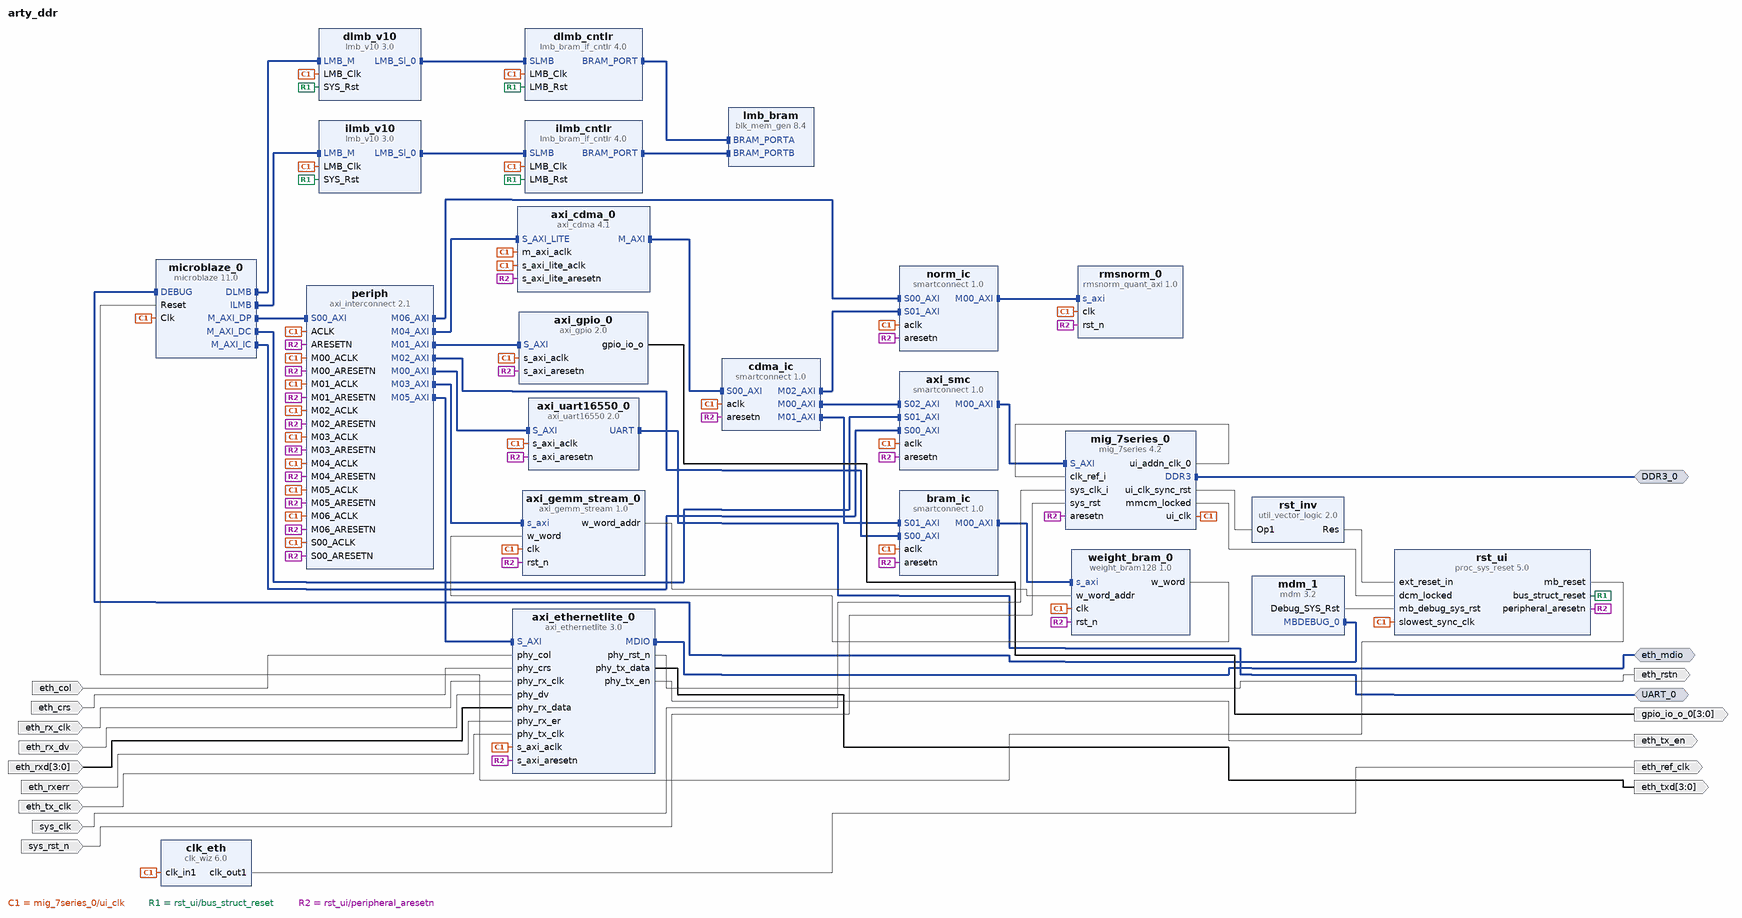
[diagram p0: block diagram of the top level]
# Vivado block design arty_ddr, xc7a100tcsg324-1, Vivado 2025.2
create_bd_design arty_ddr

create_bd_intf_port -mode Master -vlnv xilinx.com:interface:ddrx_rtl:1.0 DDR3_0
create_bd_intf_port -mode Master -vlnv xilinx.com:interface:mdio_rtl:1.0 eth_mdio
create_bd_intf_port -mode Master -vlnv xilinx.com:interface:uart_rtl:1.0 UART_0
create_bd_port -dir I -type clk sys_clk
set_property -dict {CONFIG.FREQ_HZ 100000000} [get_bd_ports sys_clk]
create_bd_port -dir I -type rst sys_rst_n
set_property -dict {CONFIG.POLARITY ACTIVE_LOW} [get_bd_ports sys_rst_n]
create_bd_port -dir I eth_tx_clk
create_bd_port -dir I eth_rx_clk
create_bd_port -dir I eth_crs
create_bd_port -dir I eth_col
create_bd_port -dir I eth_rx_dv
create_bd_port -dir I -from 3 -to 0 eth_rxd
create_bd_port -dir I eth_rxerr
create_bd_port -dir O eth_tx_en
create_bd_port -dir O -from 3 -to 0 eth_txd
create_bd_port -dir O eth_rstn
create_bd_port -dir O -type clk eth_ref_clk
create_bd_port -dir O -from 3 -to 0 gpio_io_o_0

create_bd_cell -type ip -vlnv xilinx.com:ip:mig_7series:4.2 mig_7series_0
set_property -dict {CONFIG.XML_INPUT_FILE ../../../../../../mig_a.prj} [get_bd_cells mig_7series_0]
create_bd_cell -type ip -vlnv xilinx.com:ip:proc_sys_reset:5.0 rst_ui
create_bd_cell -type ip -vlnv xilinx.com:ip:util_vector_logic:2.0 rst_inv
set_property -dict {CONFIG.C_OPERATION not CONFIG.C_SIZE 1} [get_bd_cells rst_inv]
create_bd_cell -type ip -vlnv xilinx.com:ip:microblaze:11.0 microblaze_0
set_property -dict [list \
  CONFIG.C_CACHE_BYTE_SIZE 16384 \
  CONFIG.C_DCACHE_ALWAYS_USED 1 \
  CONFIG.C_DCACHE_BASEADDR 0x0000000080000000 \
  CONFIG.C_DCACHE_BYTE_SIZE 16384 \
  CONFIG.C_DCACHE_HIGHADDR 0x000000008FFFFFFF \
  CONFIG.C_DEBUG_ENABLED 1 \
  CONFIG.C_D_AXI 1 \
  CONFIG.C_ICACHE_ALWAYS_USED 1 \
  CONFIG.C_ICACHE_BASEADDR 0x0000000080000000 \
  CONFIG.C_ICACHE_HIGHADDR 0x000000008FFFFFFF \
  CONFIG.C_USE_BARREL 1 \
  CONFIG.C_USE_DCACHE 1 \
  CONFIG.C_USE_DIV 1 \
  CONFIG.C_USE_FPU 0 \
  CONFIG.C_USE_HW_MUL 1 \
  CONFIG.C_USE_ICACHE 1 \
  CONFIG.C_USE_MSR_INSTR 1 \
  CONFIG.C_USE_PCMP_INSTR 1 \
] [get_bd_cells microblaze_0]
create_bd_cell -type ip -vlnv xilinx.com:ip:lmb_v10:3.0 dlmb_v10
create_bd_cell -type ip -vlnv xilinx.com:ip:lmb_bram_if_cntlr:4.0 dlmb_cntlr
create_bd_cell -type ip -vlnv xilinx.com:ip:lmb_v10:3.0 ilmb_v10
create_bd_cell -type ip -vlnv xilinx.com:ip:lmb_bram_if_cntlr:4.0 ilmb_cntlr
create_bd_cell -type ip -vlnv xilinx.com:ip:blk_mem_gen:8.4 lmb_bram
set_property -dict {CONFIG.Memory_Type True_Dual_Port_RAM CONFIG.use_bram_block BRAM_Controller} [get_bd_cells lmb_bram]
create_bd_cell -type ip -vlnv xilinx.com:ip:mdm:3.2 mdm_1
create_bd_cell -type ip -vlnv xilinx.com:ip:smartconnect:1.0 axi_smc
set_property -dict {CONFIG.NUM_MI 1 CONFIG.NUM_SI 3} [get_bd_cells axi_smc]
create_bd_cell -type ip -vlnv xilinx.com:ip:axi_interconnect:2.1 periph
set_property -dict {CONFIG.NUM_MI 7 CONFIG.NUM_SI 1} [get_bd_cells periph]
create_bd_cell -type ip -vlnv xilinx.com:ip:axi_uart16550:2.0 axi_uart16550_0
set_property -dict {CONFIG.C_S_AXI_ACLK_FREQ_HZ 81000000 CONFIG.C_S_AXI_ACLK_FREQ_HZ_d 81} [get_bd_cells axi_uart16550_0]
create_bd_cell -type ip -vlnv xilinx.com:ip:axi_gpio:2.0 axi_gpio_0
set_property -dict {CONFIG.C_ALL_OUTPUTS 1 CONFIG.C_GPIO_WIDTH 4} [get_bd_cells axi_gpio_0]
create_bd_cell -type ip -vlnv shepherdscientific.com:user:weight_bram128:1.0 weight_bram_0
create_bd_cell -type ip -vlnv shepherdscientific.com:user:axi_gemm_stream:1.0 axi_gemm_stream_0
create_bd_cell -type ip -vlnv xilinx.com:ip:axi_cdma:4.1 axi_cdma_0
set_property -dict {CONFIG.C_INCLUDE_SG 0 CONFIG.C_M_AXI_MAX_BURST_LEN 256} [get_bd_cells axi_cdma_0]
create_bd_cell -type ip -vlnv xilinx.com:ip:smartconnect:1.0 bram_ic
set_property -dict {CONFIG.NUM_MI 1 CONFIG.NUM_SI 2} [get_bd_cells bram_ic]
create_bd_cell -type ip -vlnv xilinx.com:ip:smartconnect:1.0 cdma_ic
set_property -dict {CONFIG.NUM_MI 3 CONFIG.NUM_SI 1} [get_bd_cells cdma_ic]
create_bd_cell -type ip -vlnv shepherdscientific.com:user:rmsnorm_quant_axi:1.0 rmsnorm_0
create_bd_cell -type ip -vlnv xilinx.com:ip:smartconnect:1.0 norm_ic
set_property -dict {CONFIG.NUM_MI 1 CONFIG.NUM_SI 2} [get_bd_cells norm_ic]
create_bd_cell -type ip -vlnv xilinx.com:ip:axi_ethernetlite:3.0 axi_ethernetlite_0
set_property -dict {CONFIG.C_INCLUDE_MDIO 1 CONFIG.C_RX_PING_PONG 1 CONFIG.C_TX_PING_PONG 1} [get_bd_cells axi_ethernetlite_0]
create_bd_cell -type ip -vlnv xilinx.com:ip:clk_wiz:6.0 clk_eth
set_property -dict [list \
  CONFIG.CLKOUT1_REQUESTED_OUT_FREQ 25.000 \
  CONFIG.USE_LOCKED false \
  CONFIG.USE_RESET false \
] [get_bd_cells clk_eth]

# ---- connections ----

connect_bd_intf_net [get_bd_intf_pins dlmb_v10/LMB_Sl_0] [get_bd_intf_pins dlmb_cntlr/SLMB]
connect_bd_intf_net [get_bd_intf_pins ilmb_v10/LMB_Sl_0] [get_bd_intf_pins ilmb_cntlr/SLMB]
connect_bd_intf_net [get_bd_intf_pins axi_cdma_0/M_AXI] [get_bd_intf_pins cdma_ic/S00_AXI]
connect_bd_intf_net [get_bd_intf_pins axi_ethernetlite_0/MDIO] [get_bd_intf_ports eth_mdio]
connect_bd_intf_net [get_bd_intf_pins axi_smc/M00_AXI] [get_bd_intf_pins mig_7series_0/S_AXI]
connect_bd_intf_net [get_bd_intf_ports UART_0] [get_bd_intf_pins axi_uart16550_0/UART]
connect_bd_intf_net [get_bd_intf_pins bram_ic/M00_AXI] [get_bd_intf_pins weight_bram_0/s_axi]
connect_bd_intf_net [get_bd_intf_pins cdma_ic/M00_AXI] [get_bd_intf_pins axi_smc/S02_AXI]
connect_bd_intf_net [get_bd_intf_pins cdma_ic/M01_AXI] [get_bd_intf_pins bram_ic/S01_AXI]
connect_bd_intf_net [get_bd_intf_pins cdma_ic/M02_AXI] [get_bd_intf_pins norm_ic/S01_AXI]
connect_bd_intf_net [get_bd_intf_pins dlmb_cntlr/BRAM_PORT] [get_bd_intf_pins lmb_bram/BRAM_PORTA]
connect_bd_intf_net [get_bd_intf_pins ilmb_cntlr/BRAM_PORT] [get_bd_intf_pins lmb_bram/BRAM_PORTB]
connect_bd_intf_net [get_bd_intf_pins mdm_1/MBDEBUG_0] [get_bd_intf_pins microblaze_0/DEBUG]
connect_bd_intf_net [get_bd_intf_pins microblaze_0/DLMB] [get_bd_intf_pins dlmb_v10/LMB_M]
connect_bd_intf_net [get_bd_intf_pins microblaze_0/ILMB] [get_bd_intf_pins ilmb_v10/LMB_M]
connect_bd_intf_net [get_bd_intf_pins microblaze_0/M_AXI_DC] [get_bd_intf_pins axi_smc/S01_AXI]
connect_bd_intf_net [get_bd_intf_pins microblaze_0/M_AXI_DP] [get_bd_intf_pins periph/S00_AXI]
connect_bd_intf_net [get_bd_intf_pins microblaze_0/M_AXI_IC] [get_bd_intf_pins axi_smc/S00_AXI]
connect_bd_intf_net [get_bd_intf_ports DDR3_0] [get_bd_intf_pins mig_7series_0/DDR3]
connect_bd_intf_net [get_bd_intf_pins norm_ic/M00_AXI] [get_bd_intf_pins rmsnorm_0/s_axi]
connect_bd_intf_net [get_bd_intf_pins periph/M00_AXI] [get_bd_intf_pins axi_uart16550_0/S_AXI]
connect_bd_intf_net [get_bd_intf_pins periph/M01_AXI] [get_bd_intf_pins axi_gpio_0/S_AXI]
connect_bd_intf_net [get_bd_intf_pins periph/M02_AXI] [get_bd_intf_pins bram_ic/S00_AXI]
connect_bd_intf_net [get_bd_intf_pins periph/M03_AXI] [get_bd_intf_pins axi_gemm_stream_0/s_axi]
connect_bd_intf_net [get_bd_intf_pins periph/M04_AXI] [get_bd_intf_pins axi_cdma_0/S_AXI_LITE]
connect_bd_intf_net [get_bd_intf_pins periph/M05_AXI] [get_bd_intf_pins axi_ethernetlite_0/S_AXI]
connect_bd_intf_net [get_bd_intf_pins periph/M06_AXI] [get_bd_intf_pins norm_ic/S00_AXI]
connect_bd_net [get_bd_pins axi_ethernetlite_0/phy_rst_n] [get_bd_ports eth_rstn]
connect_bd_net [get_bd_pins axi_ethernetlite_0/phy_tx_data] [get_bd_ports eth_txd]
connect_bd_net [get_bd_pins axi_ethernetlite_0/phy_tx_en] [get_bd_ports eth_tx_en]
connect_bd_net [get_bd_pins axi_gemm_stream_0/w_word_addr] [get_bd_pins weight_bram_0/w_word_addr]
connect_bd_net [get_bd_pins axi_gpio_0/gpio_io_o] [get_bd_ports gpio_io_o_0]
connect_bd_net [get_bd_pins clk_eth/clk_out1] [get_bd_ports eth_ref_clk]
connect_bd_net [get_bd_ports eth_col] [get_bd_pins axi_ethernetlite_0/phy_col]
connect_bd_net [get_bd_ports eth_crs] [get_bd_pins axi_ethernetlite_0/phy_crs]
connect_bd_net [get_bd_ports eth_rx_clk] [get_bd_pins axi_ethernetlite_0/phy_rx_clk]
connect_bd_net [get_bd_ports eth_rx_dv] [get_bd_pins axi_ethernetlite_0/phy_dv]
connect_bd_net [get_bd_ports eth_rxd] [get_bd_pins axi_ethernetlite_0/phy_rx_data]
connect_bd_net [get_bd_ports eth_rxerr] [get_bd_pins axi_ethernetlite_0/phy_rx_er]
connect_bd_net [get_bd_ports eth_tx_clk] [get_bd_pins axi_ethernetlite_0/phy_tx_clk]
connect_bd_net [get_bd_pins mdm_1/Debug_SYS_Rst] [get_bd_pins rst_ui/mb_debug_sys_rst]
connect_bd_net [get_bd_pins mig_7series_0/mmcm_locked] [get_bd_pins rst_ui/dcm_locked]
connect_bd_net [get_bd_pins mig_7series_0/ui_addn_clk_0] [get_bd_pins mig_7series_0/clk_ref_i]
connect_bd_net [get_bd_pins mig_7series_0/ui_clk] \
  [get_bd_pins rst_ui/slowest_sync_clk] [get_bd_pins microblaze_0/Clk] [get_bd_pins dlmb_v10/LMB_Clk] \
  [get_bd_pins dlmb_cntlr/LMB_Clk] [get_bd_pins ilmb_v10/LMB_Clk] [get_bd_pins ilmb_cntlr/LMB_Clk] [get_bd_pins axi_smc/aclk] \
  [get_bd_pins periph/ACLK] [get_bd_pins periph/S00_ACLK] [get_bd_pins periph/M00_ACLK] [get_bd_pins periph/M01_ACLK] \
  [get_bd_pins periph/M02_ACLK] [get_bd_pins periph/M03_ACLK] [get_bd_pins axi_uart16550_0/s_axi_aclk] \
  [get_bd_pins axi_gpio_0/s_axi_aclk] [get_bd_pins weight_bram_0/clk] [get_bd_pins axi_gemm_stream_0/clk] \
  [get_bd_pins periph/M04_ACLK] [get_bd_pins periph/M05_ACLK] [get_bd_pins periph/M06_ACLK] \
  [get_bd_pins axi_cdma_0/s_axi_lite_aclk] [get_bd_pins axi_cdma_0/m_axi_aclk] [get_bd_pins bram_ic/aclk] \
  [get_bd_pins cdma_ic/aclk] [get_bd_pins norm_ic/aclk] [get_bd_pins rmsnorm_0/clk] \
  [get_bd_pins axi_ethernetlite_0/s_axi_aclk] [get_bd_pins clk_eth/clk_in1]
connect_bd_net [get_bd_pins mig_7series_0/ui_clk_sync_rst] [get_bd_pins rst_inv/Op1]
connect_bd_net [get_bd_pins rst_inv/Res] [get_bd_pins rst_ui/ext_reset_in]
connect_bd_net [get_bd_pins rst_ui/bus_struct_reset] \
  [get_bd_pins dlmb_v10/SYS_Rst] [get_bd_pins dlmb_cntlr/LMB_Rst] [get_bd_pins ilmb_v10/SYS_Rst] \
  [get_bd_pins ilmb_cntlr/LMB_Rst]
connect_bd_net [get_bd_pins rst_ui/mb_reset] [get_bd_pins microblaze_0/Reset]
connect_bd_net [get_bd_pins rst_ui/peripheral_aresetn] \
  [get_bd_pins mig_7series_0/aresetn] [get_bd_pins axi_smc/aresetn] [get_bd_pins periph/ARESETN] \
  [get_bd_pins periph/S00_ARESETN] [get_bd_pins periph/M00_ARESETN] [get_bd_pins periph/M01_ARESETN] \
  [get_bd_pins periph/M02_ARESETN] [get_bd_pins periph/M03_ARESETN] [get_bd_pins axi_uart16550_0/s_axi_aresetn] \
  [get_bd_pins axi_gpio_0/s_axi_aresetn] [get_bd_pins weight_bram_0/rst_n] [get_bd_pins axi_gemm_stream_0/rst_n] \
  [get_bd_pins periph/M04_ARESETN] [get_bd_pins periph/M05_ARESETN] [get_bd_pins periph/M06_ARESETN] \
  [get_bd_pins axi_cdma_0/s_axi_lite_aresetn] [get_bd_pins bram_ic/aresetn] [get_bd_pins cdma_ic/aresetn] \
  [get_bd_pins norm_ic/aresetn] [get_bd_pins rmsnorm_0/rst_n] [get_bd_pins axi_ethernetlite_0/s_axi_aresetn]
connect_bd_net [get_bd_ports sys_clk] [get_bd_pins mig_7series_0/sys_clk_i]
connect_bd_net [get_bd_ports sys_rst_n] [get_bd_pins mig_7series_0/sys_rst]
connect_bd_net [get_bd_pins weight_bram_0/w_word] [get_bd_pins axi_gemm_stream_0/w_word]
set_property HDL_ATTRIBUTE.BMM_INFO_PROCESSOR {microblaze-le > arty_ddr dlmb_cntlr} [get_bd_cells microblaze_0]
set_property HDL_ATTRIBUTE.KEEP_HIERARCHY yes [get_bd_cells microblaze_0]
set_property HDL_ATTRIBUTE.BMM_INFO_ADDRESS_SPACE {byte  0x00000000 32 > arty_ddr lmb_bram} [get_bd_cells dlmb_cntlr]
set_property HDL_ATTRIBUTE.KEEP_HIERARCHY yes [get_bd_cells dlmb_cntlr]

# ---- address map ----
assign_bd_address -offset 0x44100000 -range 256K -target_address_space [get_bd_addr_spaces axi_cdma_0/Data] [get_bd_addr_segs weight_bram_0/s_axi/reg0]
assign_bd_address -offset 0x44400000 -range 128K -target_address_space [get_bd_addr_spaces axi_cdma_0/Data] [get_bd_addr_segs rmsnorm_0/s_axi/reg0]
assign_bd_address -offset 0x80000000 -range 256M -target_address_space [get_bd_addr_spaces axi_cdma_0/Data] [get_bd_addr_segs mig_7series_0/memmap/memaddr]
assign_bd_address -offset 0x00000000 -range 64K -target_address_space [get_bd_addr_spaces microblaze_0/Data] [get_bd_addr_segs dlmb_cntlr/SLMB/Mem]
assign_bd_address -offset 0x40000000 -range 64K -target_address_space [get_bd_addr_spaces microblaze_0/Data] [get_bd_addr_segs axi_gpio_0/S_AXI/Reg]
assign_bd_address -offset 0x40600000 -range 64K -target_address_space [get_bd_addr_spaces microblaze_0/Data] [get_bd_addr_segs axi_uart16550_0/S_AXI/Reg]
assign_bd_address -offset 0x40E00000 -range 64K -target_address_space [get_bd_addr_spaces microblaze_0/Data] [get_bd_addr_segs axi_ethernetlite_0/S_AXI/Reg]
assign_bd_address -offset 0x44100000 -range 256K -target_address_space [get_bd_addr_spaces microblaze_0/Data] [get_bd_addr_segs weight_bram_0/s_axi/reg0]
assign_bd_address -offset 0x44200000 -range 4K -target_address_space [get_bd_addr_spaces microblaze_0/Data] [get_bd_addr_segs axi_gemm_stream_0/s_axi/reg0]
assign_bd_address -offset 0x44300000 -range 64K -target_address_space [get_bd_addr_spaces microblaze_0/Data] [get_bd_addr_segs axi_cdma_0/S_AXI_LITE/Reg]
assign_bd_address -offset 0x44400000 -range 128K -target_address_space [get_bd_addr_spaces microblaze_0/Data] [get_bd_addr_segs rmsnorm_0/s_axi/reg0]
assign_bd_address -offset 0x80000000 -range 256M -target_address_space [get_bd_addr_spaces microblaze_0/Data] [get_bd_addr_segs mig_7series_0/memmap/memaddr]
assign_bd_address -offset 0x00000000 -range 64K -target_address_space [get_bd_addr_spaces microblaze_0/Instruction] [get_bd_addr_segs ilmb_cntlr/SLMB/Mem]
assign_bd_address -offset 0x80000000 -range 256M -target_address_space [get_bd_addr_spaces microblaze_0/Instruction] [get_bd_addr_segs mig_7series_0/memmap/memaddr]

validate_bd_design
save_bd_design
